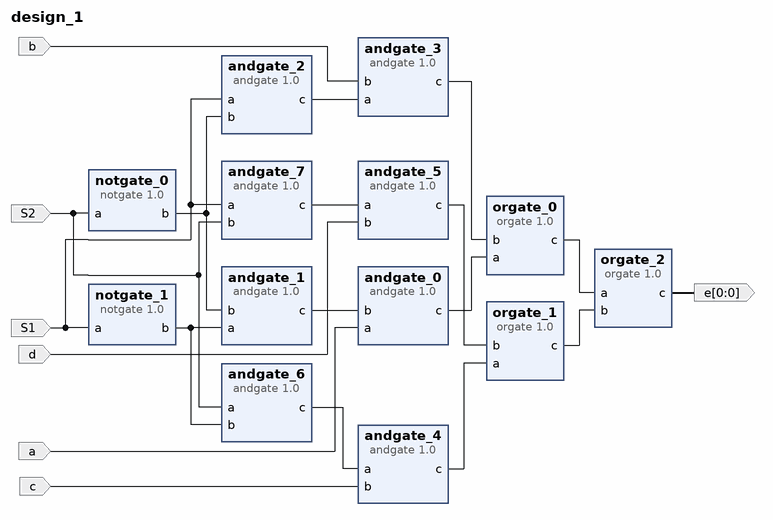
[diagram p0: block diagram of the top level]
# Vivado block design design_1, xc7a35tcpg236-1, Vivado 2018.3
create_bd_design design_1

create_bd_port -dir I S1
create_bd_port -dir I S2
create_bd_port -dir I a
create_bd_port -dir I b
create_bd_port -dir I c
create_bd_port -dir I d
create_bd_port -dir O -from 0 -to 0 e

create_bd_cell -type ip -vlnv xilinx.com:user:andgate:1.0 andgate_0
set_property -dict {CONFIG.WIDTH 1} [get_bd_cells andgate_0]
create_bd_cell -type ip -vlnv xilinx.com:user:notgate:1.0 notgate_0
set_property -dict {CONFIG.WIDTH 1} [get_bd_cells notgate_0]
create_bd_cell -type ip -vlnv xilinx.com:user:notgate:1.0 notgate_1
set_property -dict {CONFIG.WIDTH 1} [get_bd_cells notgate_1]
create_bd_cell -type ip -vlnv xilinx.com:user:orgate:1.0 orgate_0
set_property -dict {CONFIG.WIDTH 1} [get_bd_cells orgate_0]
create_bd_cell -type ip -vlnv xilinx.com:user:andgate:1.0 andgate_1
set_property -dict {CONFIG.WIDTH 1} [get_bd_cells andgate_1]
create_bd_cell -type ip -vlnv xilinx.com:user:orgate:1.0 orgate_1
set_property -dict {CONFIG.WIDTH 1} [get_bd_cells orgate_1]
create_bd_cell -type ip -vlnv xilinx.com:user:orgate:1.0 orgate_2
set_property -dict {CONFIG.WIDTH 1} [get_bd_cells orgate_2]
create_bd_cell -type ip -vlnv xilinx.com:user:andgate:1.0 andgate_2
set_property -dict {CONFIG.WIDTH 1} [get_bd_cells andgate_2]
create_bd_cell -type ip -vlnv xilinx.com:user:andgate:1.0 andgate_3
set_property -dict {CONFIG.WIDTH 1} [get_bd_cells andgate_3]
create_bd_cell -type ip -vlnv xilinx.com:user:andgate:1.0 andgate_4
set_property -dict {CONFIG.WIDTH 1} [get_bd_cells andgate_4]
create_bd_cell -type ip -vlnv xilinx.com:user:andgate:1.0 andgate_5
set_property -dict {CONFIG.WIDTH 1} [get_bd_cells andgate_5]
create_bd_cell -type ip -vlnv xilinx.com:user:andgate:1.0 andgate_6
set_property -dict {CONFIG.WIDTH 1} [get_bd_cells andgate_6]
create_bd_cell -type ip -vlnv xilinx.com:user:andgate:1.0 andgate_7
set_property -dict {CONFIG.WIDTH 1} [get_bd_cells andgate_7]

# ---- connections ----

connect_bd_net -net S1_1 [get_bd_ports S1] [get_bd_pins notgate_1/a] [get_bd_pins andgate_2/a] [get_bd_pins andgate_7/a]
connect_bd_net -net S2_1 [get_bd_ports S2] [get_bd_pins notgate_0/a] [get_bd_pins andgate_7/b] [get_bd_pins andgate_6/a]
connect_bd_net [get_bd_pins notgate_1/b] [get_bd_pins andgate_1/a] [get_bd_pins andgate_6/b]
connect_bd_net [get_bd_pins notgate_0/b] [get_bd_pins andgate_1/b] [get_bd_pins andgate_2/b]
connect_bd_net [get_bd_pins andgate_1/c] [get_bd_pins andgate_0/b]
connect_bd_net [get_bd_ports a] [get_bd_pins andgate_0/a]
connect_bd_net [get_bd_pins andgate_0/c] [get_bd_pins orgate_0/a]
connect_bd_net [get_bd_pins andgate_3/c] [get_bd_pins orgate_0/b]
connect_bd_net [get_bd_pins andgate_4/c] [get_bd_pins orgate_1/a]
connect_bd_net [get_bd_pins andgate_5/c] [get_bd_pins orgate_1/b]
connect_bd_net [get_bd_pins orgate_0/c] [get_bd_pins orgate_2/a]
connect_bd_net [get_bd_pins orgate_1/c] [get_bd_pins orgate_2/b]
connect_bd_net [get_bd_pins orgate_2/c] [get_bd_ports e]
connect_bd_net [get_bd_pins andgate_2/c] [get_bd_pins andgate_3/a]
connect_bd_net [get_bd_pins andgate_6/c] [get_bd_pins andgate_4/a]
connect_bd_net [get_bd_pins andgate_7/c] [get_bd_pins andgate_5/a]
connect_bd_net [get_bd_ports d] [get_bd_pins andgate_5/b]
connect_bd_net [get_bd_ports c] [get_bd_pins andgate_4/b]
connect_bd_net [get_bd_ports b] [get_bd_pins andgate_3/b]

validate_bd_design
save_bd_design
